# EAGLE design untitled (EAGLE 9.6.2)
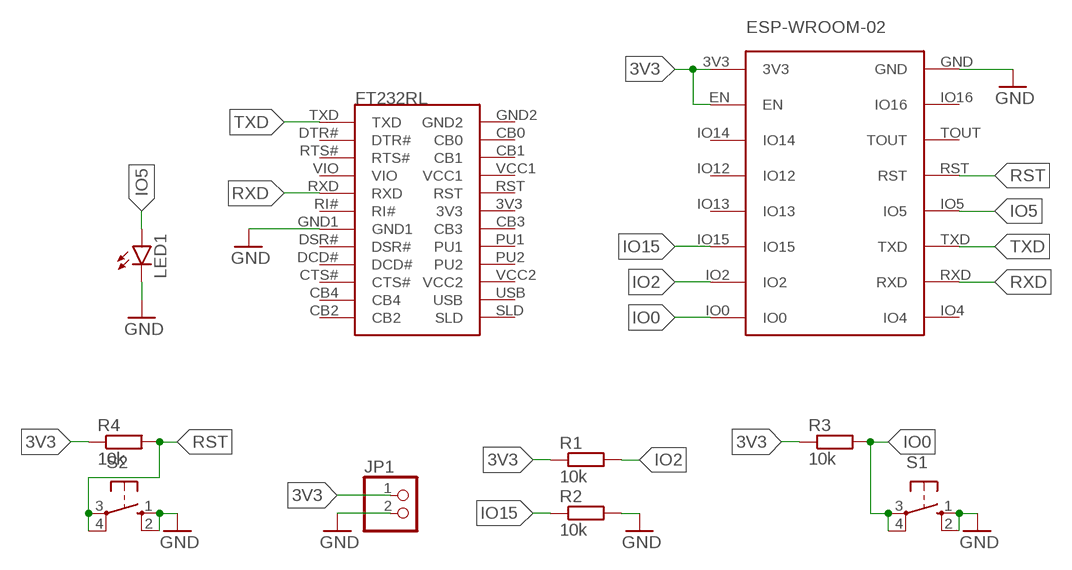
[diagram p0: schematic, sheet 1]

## Parts
ESP-WROOM-1  ESP-WROOM-02  [ESP-WROOM-02]
FT232RL1  FT232RL  [FT232RL]
JP1  PINHD-1X2  [1X02]
LED1  LED5MM  [LED5MM]
R1  10k  R-EU_0204/7  [0204/7]
R2  10k  R-EU_0204/7  [0204/7]
R3  10k  R-EU_0204/7  [0204/7]
R4  10k  R-EU_0204/7  [0204/7]
S1  10-XX  [B3F-10XX]
S2  10-XX  [B3F-10XX]

## Nets
3V3 [ESP-WROOM-02]: ESP-WROOM-1.3V3 ESP-WROOM-1.EN JP1.1 R1.1 R3.1 R4.1
GND: ESP-WROOM-1.GND FT232RL1.GND1 JP1.2 LED1.K(C) R2.2 S1.1(S) S1.2(S1) S2.1(S) S2.2(S1)
IO0 [ESP-WROOM-02]: ESP-WROOM-1.IO0 R3.2 S1.3(P) S1.4(P1)
IO2 [ESP-WROOM-02]: ESP-WROOM-1.IO2 R1.2
IO5 [ESP-WROOM-02]: ESP-WROOM-1.IO5 LED1.A
IO15 [ESP-WROOM-02]: ESP-WROOM-1.IO15 R2.1
RST [ESP-WROOM-02]: ESP-WROOM-1.RST R4.2 S2.3(P) S2.4(P1)
RXD [UART]: ESP-WROOM-1.RXD FT232RL1.RXD
TXD [UART]: ESP-WROOM-1.TXD FT232RL1.TXD
Unconnected: ESP-WROOM-1.IO4 ESP-WROOM-1.IO12 ESP-WROOM-1.IO13 ESP-WROOM-1.IO14 ESP-WROOM-1.IO16 ESP-WROOM-1.TOUT FT232RL1.3V3 FT232RL1.CB0 FT232RL1.CB1 FT232RL1.CB2 FT232RL1.CB3 FT232RL1.CB4 FT232RL1.CTS# FT232RL1.DCD# FT232RL1.DSR# FT232RL1.DTR# FT232RL1.GND2 FT232RL1.PU1 FT232RL1.PU2 FT232RL1.RI# FT232RL1.RST FT232RL1.RTS# FT232RL1.SLD FT232RL1.USB FT232RL1.VCC1 FT232RL1.VCC2 FT232RL1.VIO

## Library data of the parts
ESP-WROOM-1 = ESP-WROOM-02:ESP-WROOM-02
FT232RL1 = FT232RL:FT232RL
JP1 = pinhead:PINHD-1X2: PIN HEADER
LED1 = led:LED: LED OSRAM: - CHIPLED LG R971, LG N971, LY N971, LG Q971, LY Q971, LO R971, LY R971 LH N974, LH R974 LS Q976, LO Q976, LY Q976 LO Q996 - Hyper CHIPLED LW Q18S LB Q993, LB Q99A, LB R99A - SideLED LS A670, LO A670, LY A670, LG A670, LP A670 LB A673, LV A673, LT A673, LW A673 LH A674 LY A675 LS A676, LA A676, LO A676, LY A676, LW A676 LS A679, LY A679, LG A679 - Hyper Micro SIDELED® LS Y876, LA Y876, LO Y876, LY Y876 LT Y87S - SmartLED LW L88C, LW L88S LB L89C, LB L89S, LG L890 LS L89K, LO L89K, LY L89K LS L896, LA L896, LO L896, LY L896 - TOPLED LS T670, LO T670, LY T670, LG T670, LP T670 LSG T670, LSP T670, LSY T670, LOP T670, LYG T670 LG T671, LOG T671, LSG T671 LB T673, LV T673, LT T673, LW T673 LH T674 LS T676, LA T676, LO T676, LY T676, LB T676, LH T676, LSB T676, LW T676 LB T67C, LV T67C, LT T67C, LS T67K, LO T67K, LY T67K, LW E67C LS E67B, LA E67B, LO E67B, LY E67B, LB E67C, LV E67C, LT E67C LW T67C LS T679, LY T679, LG T679 LS T770, LO T770, LY T770, LG T770, LP T770 LB T773, LV T773, LT T773, LW T773 LH T774 LS E675, LA E675, LY E675, LS T675 LS T776, LA T776, LO T776, LY T776, LB T776 LHGB T686 LT T68C, LB T68C - Hyper Mini TOPLED® LB M676 - Mini TOPLED Santana® LG M470 LS M47K, LO M47K, LY M47K Source: http://www.osram.convergy.de LUXEON: - LUMILED® LXK2-PW12-R00, LXK2-PW12-S00, LXK2-PW14-U00, LXK2-PW14-V00 LXK2-PM12-R00, LXK2-PM12-S00, LXK2-PM14-U00 LXK2-PE12-Q00, LXK2-PE12-R00, LXK2-PE12-S00, LXK2-PE14-T00, LXK2-PE14-U00 LXK2-PB12-K00, LXK2-PB12-L00, LXK2-PB12-M00, LXK2-PB14-N00, LXK2-PB14-P00, LXK2-PB14-Q00 LXK2-PR12-L00, LXK2-PR12-M00, LXK2-PR14-Q00, LXK2-PR14-R00 LXK2-PD12-Q00, LXK2-PD12-R00, LXK2-PD12-S00 LXK2-PH12-R00, LXK2-PH12-S00 LXK2-PL12-P00, LXK2-PL12-Q00, LXK2-PL12-R00 Source: www.luxeon.com KINGBRIGHT: KA-3528ASYC Source: www.kingbright.com
R1-R4 = rcl:R-EU_: RESISTOR, European symbol; SPICEPREFIX: R
S1 S2 = switch-omron:10-XX: OMRON SWITCH; MPN: B3F-1000; OC_FARNELL: 176432; OC_NEWARK: 36M3542

## Net classes
0 default: clearance 0.61 mm
1 UART: clearance 0.61 mm
2 ESP-WROOM-02: clearance 0.61 mm

## Board
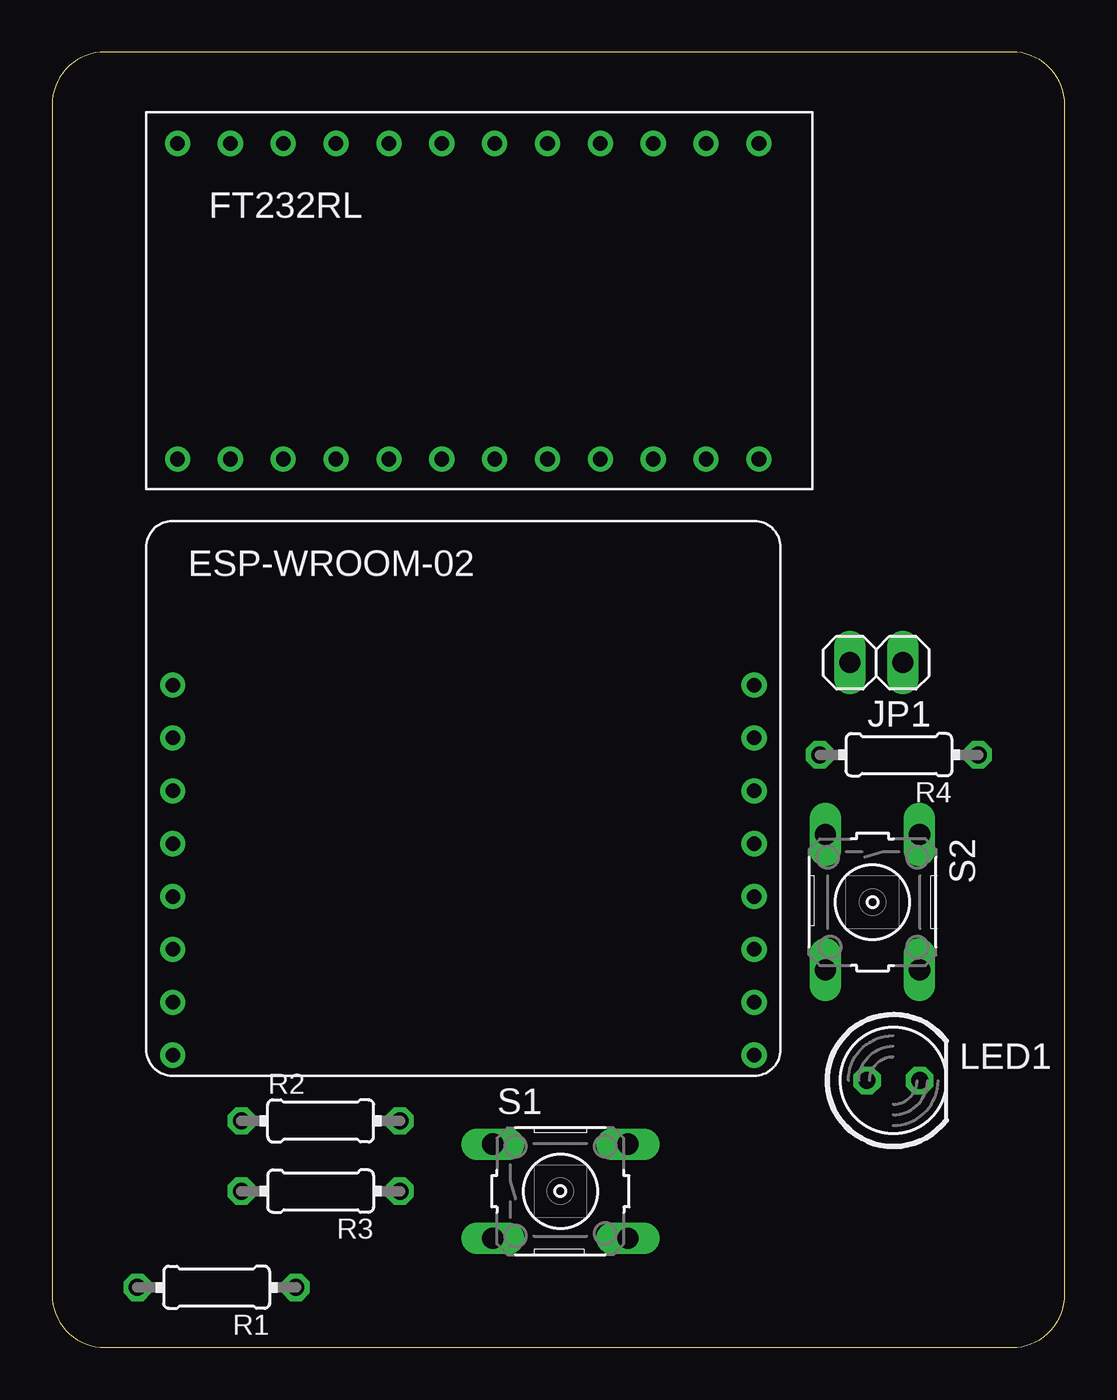
[diagram p1: board, top side]
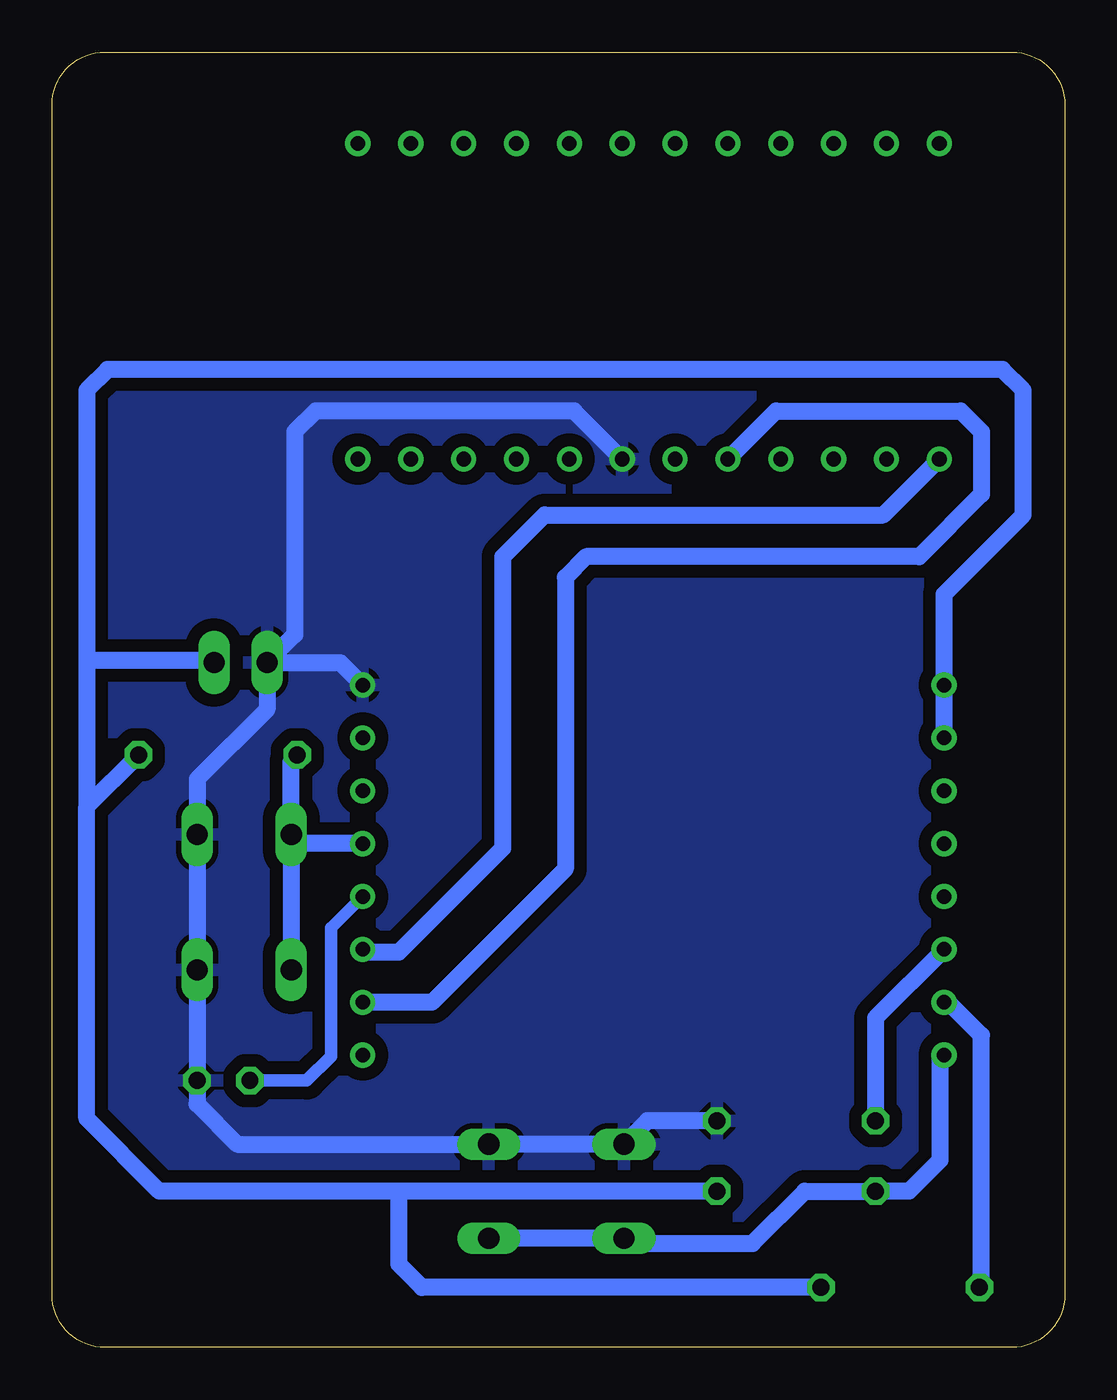
[diagram p2: board, bottom side, seen from below]

Size 48.67 x 62.25 mm. Coordinates in mm from the lower left corner, seen from the top.
Outline: 48.67,2.54 48.67,59.71 arc90 46.13,62.25 2.54,62.25 arc90 0,59.71 0,2.54 arc90 2.54,0 46.13,0 arc90 48.67,2.54
Copper layers (1*16): Top 0.035mm / dielectric 1.5mm / Bottom 0.035mm
Design rules "default": minimum track width 6mil, minimum drill 0.35mm, track to track 6mil, track to pad 6mil, pad to pad 6mil, via to via 6mil, smd to smd 6mil, copper to edge 40mil, drill to drill 6mil, minimum pad ring 10mil, minimum via ring 8mil, stop-mask expansion 4mil, vias tented up to drill 0mil, thermal gap 10mil

### Footprints (pad centres in the part's own frame; a part is rotated, then mirrored left to right if it is on the bottom)
ESP-WROOM-02 = drill 0.7: 3V3 1.27,18.78; EN 1.27,16.24; GND 29.21,18.78; IO0 1.27,1; IO2 1.27,3.54; IO4 29.21,1; IO5 29.21,8.62; IO12 1.27,11.16; IO13 1.27,8.62; IO14 1.27,13.7; IO15 1.27,6.08; IO16 29.21,16.24; RST 29.21,11.16; RXD 29.21,3.54; TOUT 29.21,13.7; TXD 29.21,6.08
FT232RL = drill 0.7: 3V3 14.2,16.6; CB0 4.04,16.6; CB1 6.58,16.6; CB2 29.44,1.43; CB3 16.74,16.6; CB4 26.9,1.43; CTS# 24.36,1.43; DCD# 21.82,1.43; DSR# 19.28,1.43; DTR# 4.04,1.43; GND1 16.74,1.43; GND2 1.5,16.6; PU1 19.28,16.6; PU2 21.82,16.6; RI# 14.2,1.43; RST 11.66,16.6; RTS# 6.58,1.43; RXD 11.66,1.43; SLD 29.44,16.6; TXD 1.5,1.43; USB 26.9,16.6; VCC1 9.12,16.6; VCC2 24.36,16.6; VIO 9.12,1.43
1X02 = drill 1.016 long: 1 -1.27,0; 2 1.27,0
LED5MM = drill 0.813 octagon: A -1.27,0; K 1.27,0
0204/7 = drill 0.813 octagon: 1 -3.81,0; 2 3.81,0
B3F-10XX = drill 1.016 long: 1 -3.251,2.261; 2 3.251,2.261; 3 -3.251,-2.261; 4 3.251,-2.261

### Placement (x,y rotation side)
ESP-WROOM-1  4.53,13.05 0 top
FT232RL1  4.53,41.26 0 top
JP1  39.61,32.91 180 top
LED1  40.43,12.83 0 top
R1  7.91,2.89 180 top
R2  12.91,10.89 0 top
R3  12.91,7.51 180 top
R4  40.7,28.48 180 top
S1  24.43,7.51 0 top
S2  39.43,21.4 270 top

### Tracks (layer width: path | path; a pad name or v marks a point on that pad's centre or on a via)
3V3
  Bottom 0.813: R3.1 32,7.51 | 32,7.51 43.51,7.51 47,11 47,25.99 | 47,25.99 R4.1 | R1.1 30.89,2.89 32,4 32,7.51 | ESP-WROOM-1.EN ESP-WROOM-1.3V3 5.8,36.2 2,40 2,46 3,47 46,47 47,46 47,33 | 47,33 47,25.99 | JP1.1 40.97,33 47,33
GND
  Bottom 0.813: R2.2 20.06,10.89 S1.1 S1.2 39.77,9.77 41.7,11.7 LED1.K 41.7,18.14 S2.2 S2.1 41.69,27.31 38.34,30.66 JP1.2 | JP1.2 34.82,32.91 ESP-WROOM-1.GND | FT232RL1.GND1 23.58,45 36,45 37,44 37,34.25 JP1.2
  pour Bottom: 0,62 0,0 48,0 49,0 49,62
IO0
  Bottom 0.813: ESP-WROOM-1.IO0 6,13.85 6,9 7.49,7.51 R3.2 12.49,7.51 15,5 20.93,5 S1.3 S1.4
IO2
  Bottom 0.813: R1.2 4,2.99 4,15 5.59,16.59 ESP-WROOM-1.IO2
IO5
  Bottom 0.6: ESP-WROOM-1.IO5 35.25,20.16 35.25,14 36.42,12.83 LED1.A
IO15
  Bottom 0.813: ESP-WROOM-1.IO15 9.1,15.83 R2.1
RST
  Bottom 0.813: ESP-WROOM-1.RST 36.73,24.21 S2.3 | S2.3 37.17,28.2 R4.2 | S2.3 S2.4
RXD
  Bottom 0.813: FT232RL1.RXD 13.88,45 5,45 4,44 4,41 7,38 23,38 24,37 24,23 30.41,16.59 ESP-WROOM-1.RXD
TXD
  Bottom 0.813: ESP-WROOM-1.TXD 33.61,19 32,19 27,24 27,38 25,40 8.72,40 FT232RL1.TXD